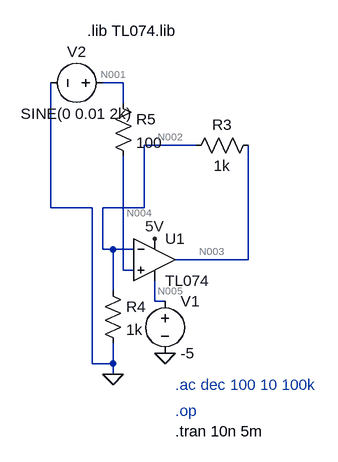
[diagram p0: schematic piezoamp_offset.asc]
piezoamp_offset.asc, the LTspice schematic file:
Version 4
SHEET 1 880 1696
WIRE -224 1104 -256 1104
WIRE -224 1136 -224 1104
WIRE -112 1200 -192 1200
WIRE -336 1296 -336 1104
WIRE -272 1296 -336 1296
WIRE -192 1296 -192 1200
WIRE -192 1296 -256 1296
WIRE -256 1360 -256 1296
WIRE -240 1360 -256 1360
WIRE -208 1360 -240 1360
WIRE -32 1376 -32 1200
WIRE -32 1376 -144 1376
WIRE -224 1392 -224 1216
WIRE -208 1392 -224 1392
WIRE -240 1424 -240 1360
WIRE -176 1440 -176 1408
WIRE -160 1440 -176 1440
WIRE -272 1536 -272 1296
WIRE -240 1536 -240 1504
WIRE -240 1536 -272 1536
WIRE -240 1552 -240 1536
FLAG -176 1344 5V
FLAG -240 1552 0
FLAG -160 1520 0
SYMBOL OpAmps/opamp2 -176 1312 R0
SYMATTR InstName U1
SYMATTR Value TL074
SYMBOL voltage -240 1104 R90
WINDOW 0 -32 56 VBottom 2
WINDOW 3 32 56 VTop 2
SYMATTR InstName V2
SYMATTR Value SINE(0 0.01 2k)
SYMBOL Res -16 1184 R90
WINDOW 0 0 56 VBottom 2
WINDOW 3 32 56 VTop 2
SYMATTR InstName R3
SYMATTR Value 1k
SYMBOL Res -256 1408 R0
SYMATTR InstName R4
SYMATTR Value 1k
SYMBOL Res -240 1120 R0
SYMATTR InstName R5
SYMATTR Value 100
SYMBOL voltage -160 1424 R0
SYMATTR InstName V1
SYMATTR Value -5
TEXT -144 1568 Left 2 ;.ac dec 100 10 100k
TEXT -144 1608 Left 2 ;.op
TEXT -144 1640 Left 2 !.tran 10n 5m
TEXT -280 1024 Left 2 !.lib TL074.lib

The netlist it stands for:
* piezoamp_offset.asc
XU1 N004 N002 5V N005 N003 TL074  ; pins In+ In- V+ V- OUT
V2 N001 0 SINE(0 0.01 2k)
R3 N003 N002 1k
R4 N002 0 1k
R5 N001 N004 100
V1 N005 0 -5
* .ac dec 100 10 100k
* .op
.tran 10n 5m
.lib TL074.lib
.backanno
.end

* Results of the author's LTspice run, read from the files saved beside the schematic
* Operating Point, zero values left out:
*   V(n003) = -3.529 V
*   V(n005) = -5 V
*   V(5v) = -2.061 V
*   V(n002) = -1.764 V
*   I(R3) = -1.764 mA
*   I(R4) = -1.764 mA
*   I(R5) = 36.92 pA
*   I(V2) = -36.92 pA
*   I(V1) = 180.8 µA
*   Ix(u1:1) = 36.92 pA
*   Ix(u1:2) = 32.67 pA
*   Ix(u1:4) = -180.8 µA
*   Ix(u1:5) = 1.764 mA
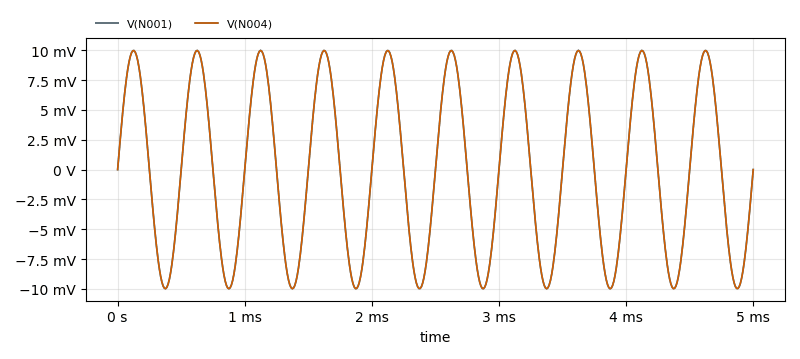
[diagram p1: Transient Analysis of piezoamp_offset.asc, plotted from the saved traces]
* Transient Analysis, 1 run:
*   V(N001): min -10 mV, max 10 mV, average 2.705 nV, rms 7.086 mV, last 0 V
*   V(N004): min -9.99 mV, max 9.991 mV, average 0 V, rms 7.079 mV, last -3.692 nV